# Altium schematic sheet UniversalFullBridge.SchDoc
size A
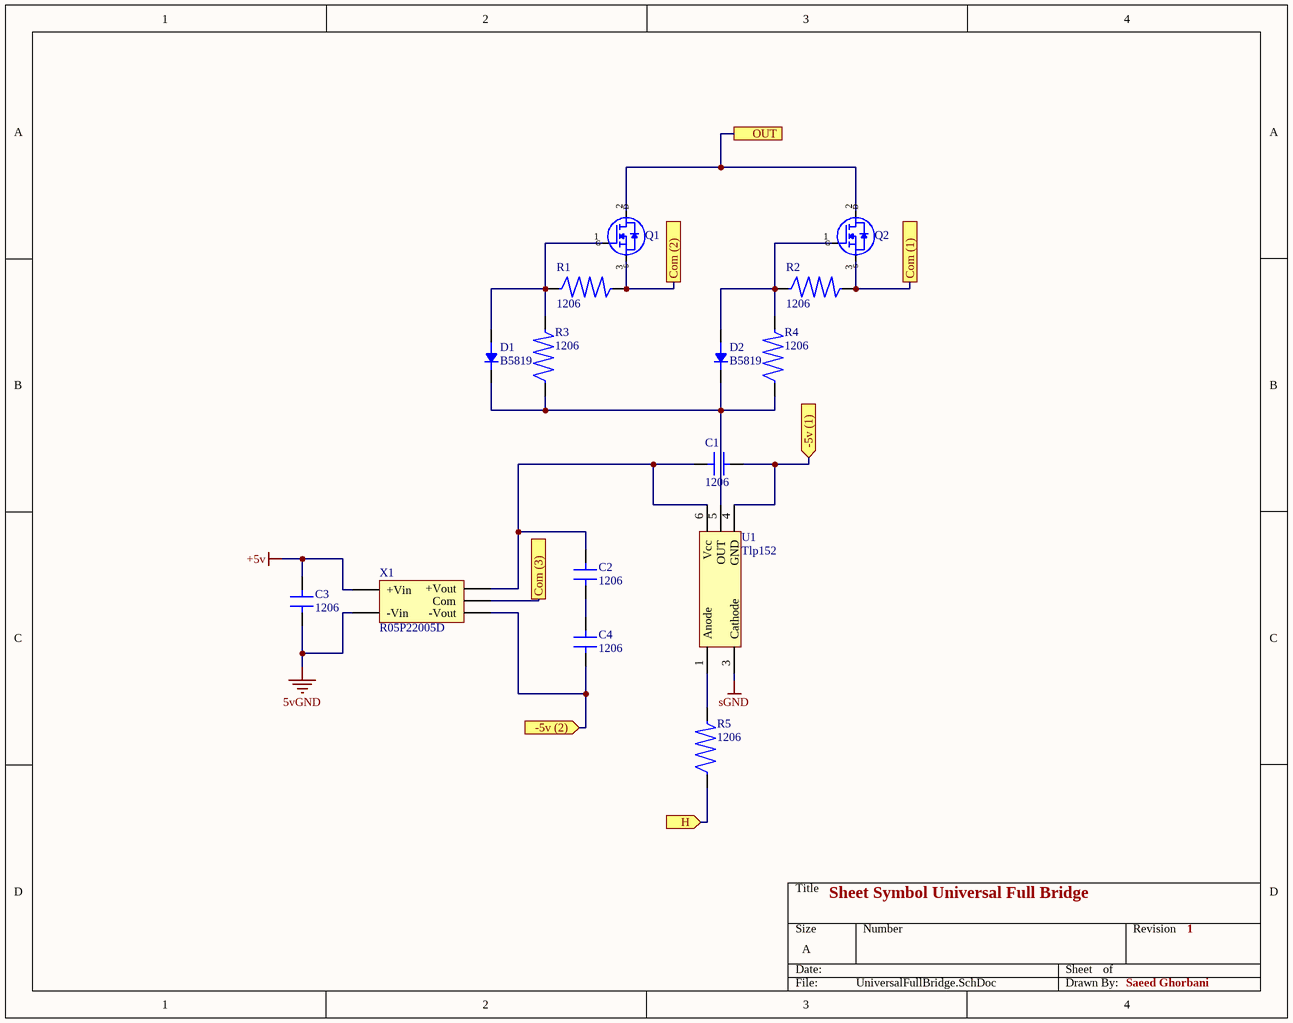
[diagram p0: UniversalFullBridge.SchDoc]

## Parts
C1  1206
C2  1206
C3  1206
C4  1206
D1  B5819
D2  B5819
Q1  To263 Mosfet  (value not drawn)
Q2  To263 Mosfet  (value not drawn)
R1  1206
R2  1206
R3  1206
R4  1206
R5  1206
U1  Tlp152
X1  R05P22005D

## Ports
-5v (1) (in), -5v (2) (in), Com (1), Com (2), Com (3), H (in), OUT

## Nets
5vGND: C3.1 X1.2(-Vin)
+5v: C3.2 X1.1(+Vin)
sGND: U1.3(Cathode)
-5v (1): C1.2 U1.4(GND) ; port -5v (1)
-5v (2): C4.1 X1.5(-Vout) ; port -5v (2)
Com (1): Q2.3(S) R2.2 ; port Com (1)
Com (2): Q1.3(S) R1.2 ; port Com (2)
Com (3): X1.6(Com) ; port Com (3)
H: R5.1 ; port H
OUT: Q1.2(D) Q2.2(D) ; port OUT
NetC1_1: C1.1 C2.2 U1.6(Vcc) X1.7(+Vout)
NetC2_1: C2.1 C4.2
NetD1_1: D1.1(Anode) Q1.1(G) R1.1 R3.2
NetD1_2: D1.2(Cathode) D2.2(Cathode) R3.1 R4.1 U1.5(OUT)
NetD2_1: D2.1(Anode) Q2.1(G) R2.1 R4.2
NetR5_2: R5.2 U1.1(Anode)

## Notes on the sheet
- Sheet Symbol Universal Full Bridge
- 1
- Saeed Ghorbani

## Library data of the parts
C1-C4 = Capcitor (1206)
D1 D2 = Diode
R1-R5 = Resistor (1206)
X1 = DC_DC Converter